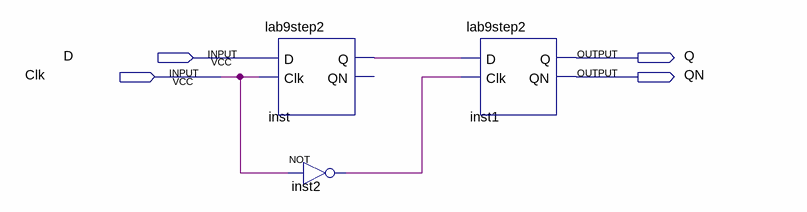
[diagram p0: schematic sheet]
// Quartus schematic lab9step2a.bdf as structural Verilog: 3 symbols, 4 pins
module lab9step2a (
  input  D,
  input  Clk,
  output Q,
  output QN
);

  wire inst2_out, inst_q;

  lab9step2 inst (.D(D), .Clk(Clk), .Q(inst_q));  // open: QN
  not inst2 (inst2_out, Clk);
  lab9step2 inst1 (.D(inst_q), .Clk(inst2_out), .Q(Q), .QN(QN));
endmodule
